# Altium schematic sheet User IO.SchDoc
size A1; SheetNumber: 10; SheetTotal: 14
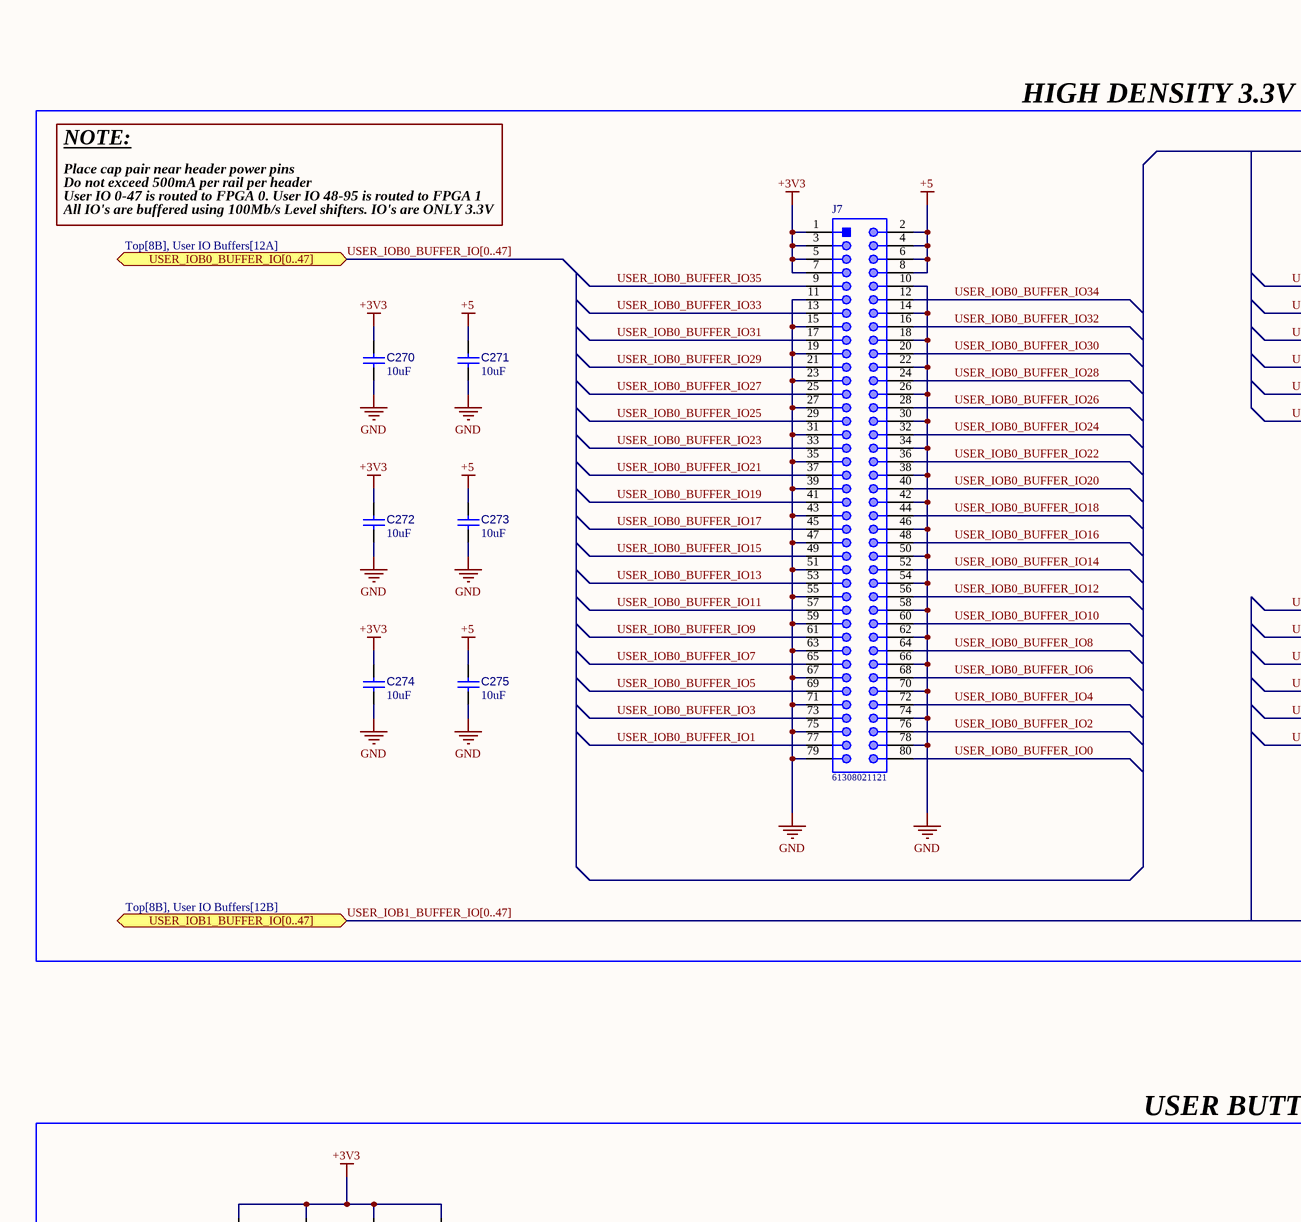
[diagram p0: User IO.SchDoc, top left]
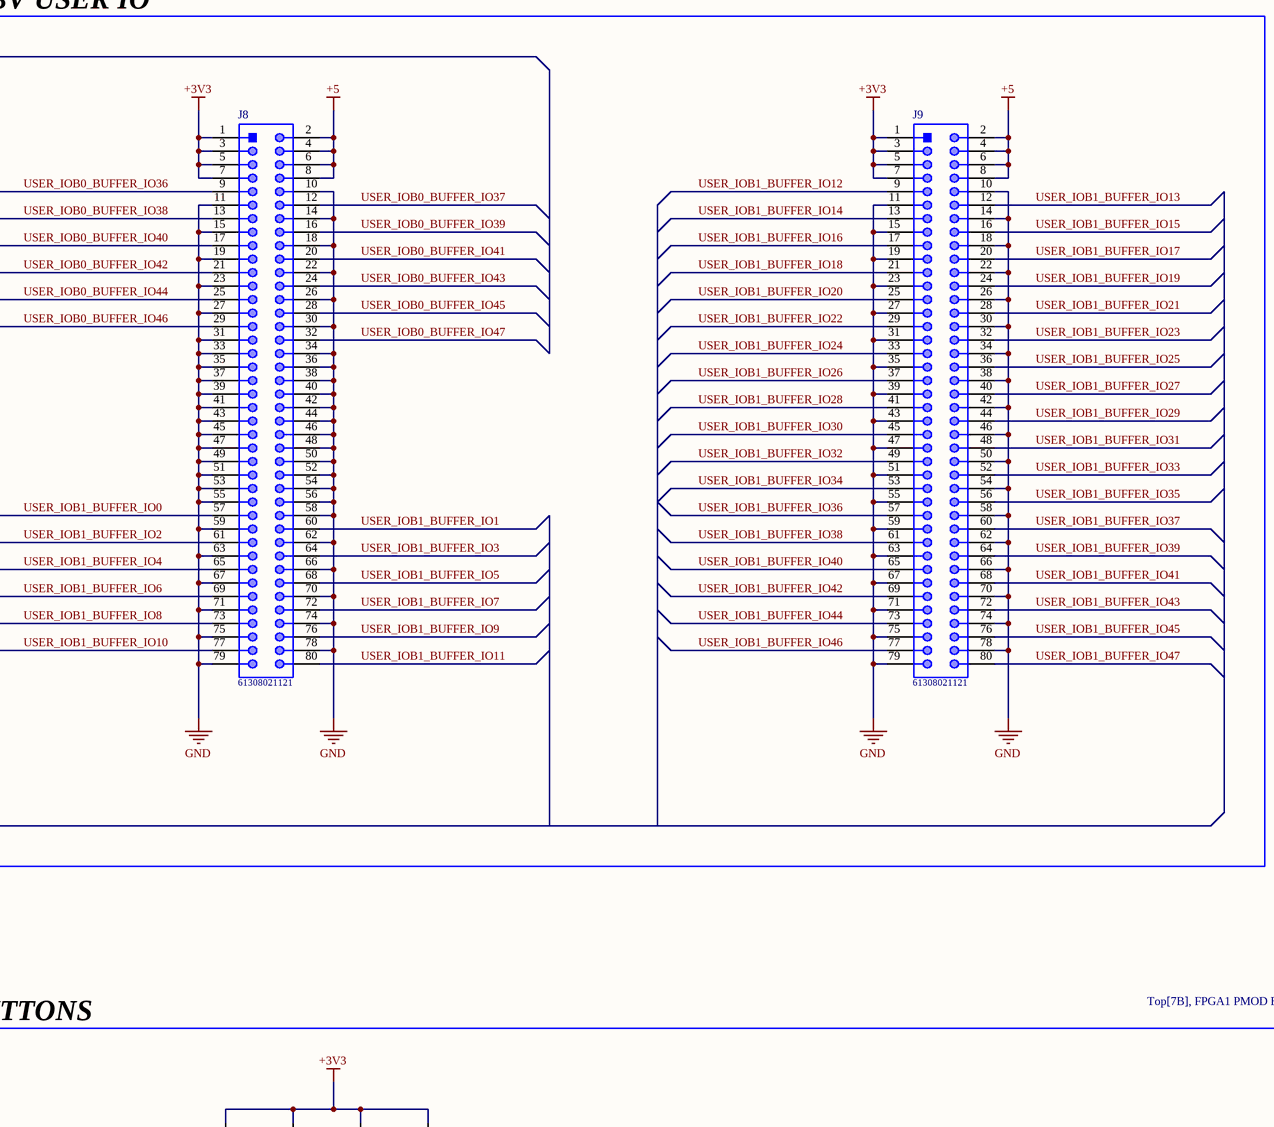
[diagram p1: User IO.SchDoc, top middle]
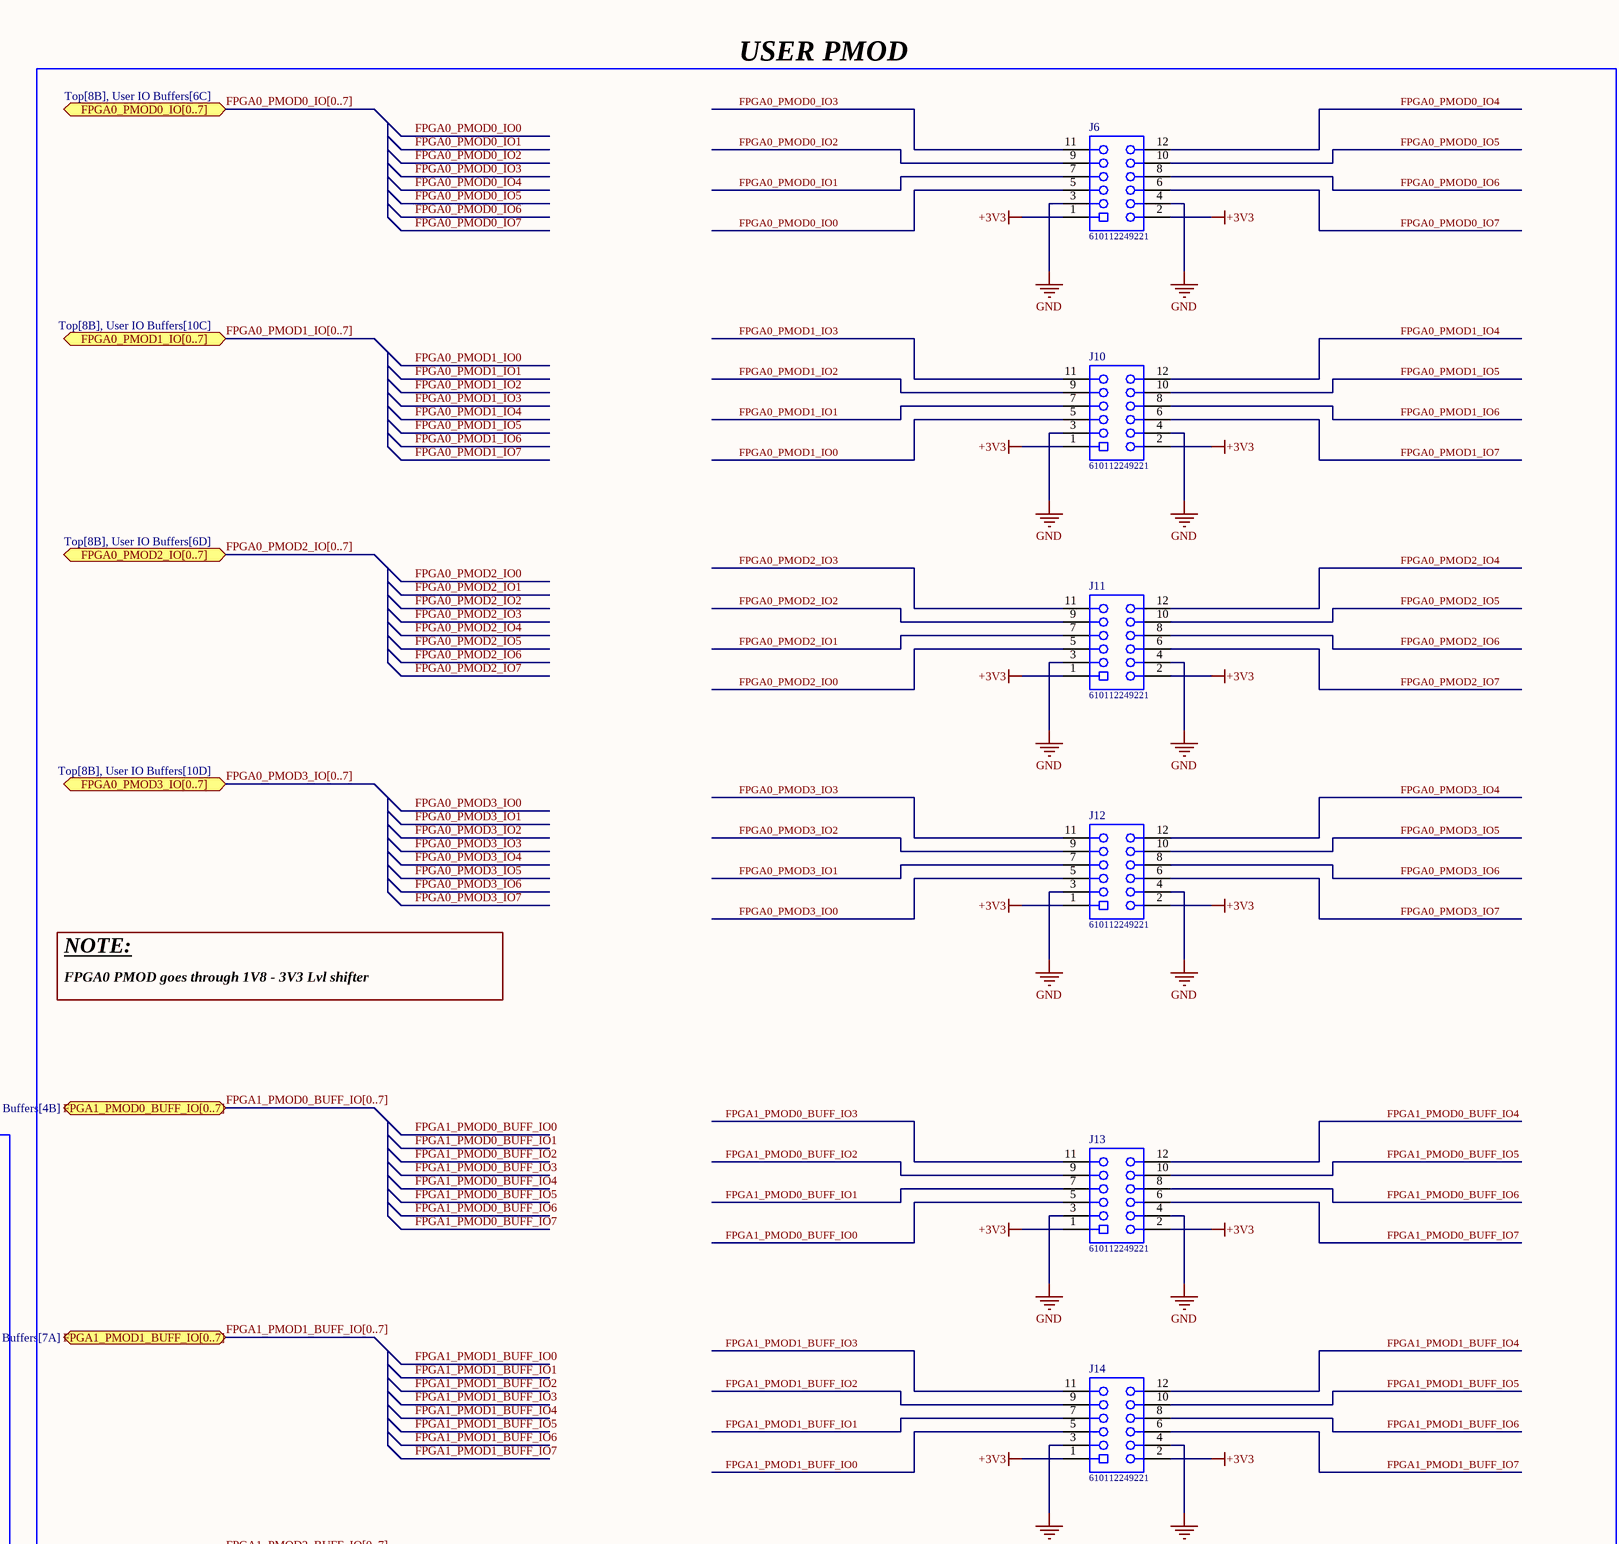
[diagram p2: User IO.SchDoc, top right]
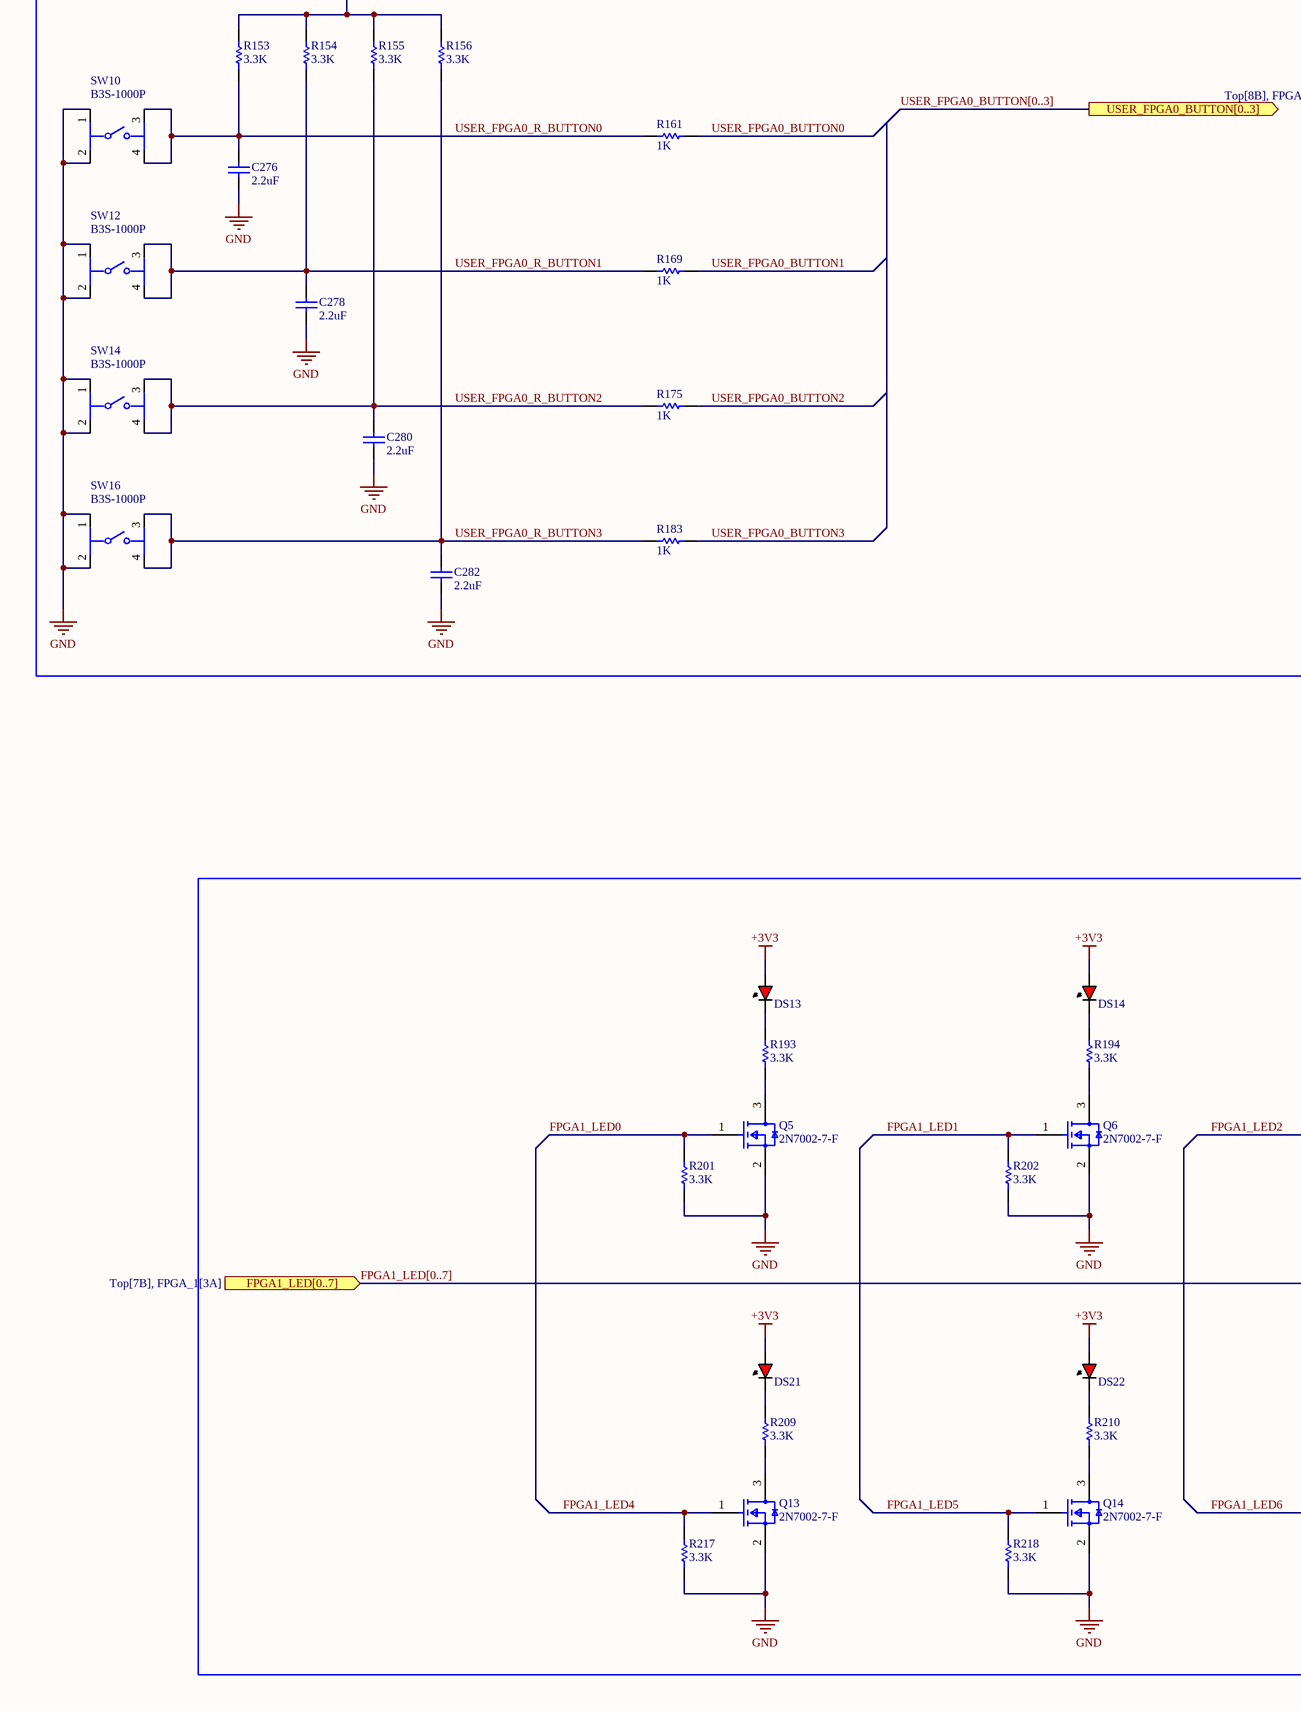
[diagram p3: User IO.SchDoc, bottom left]
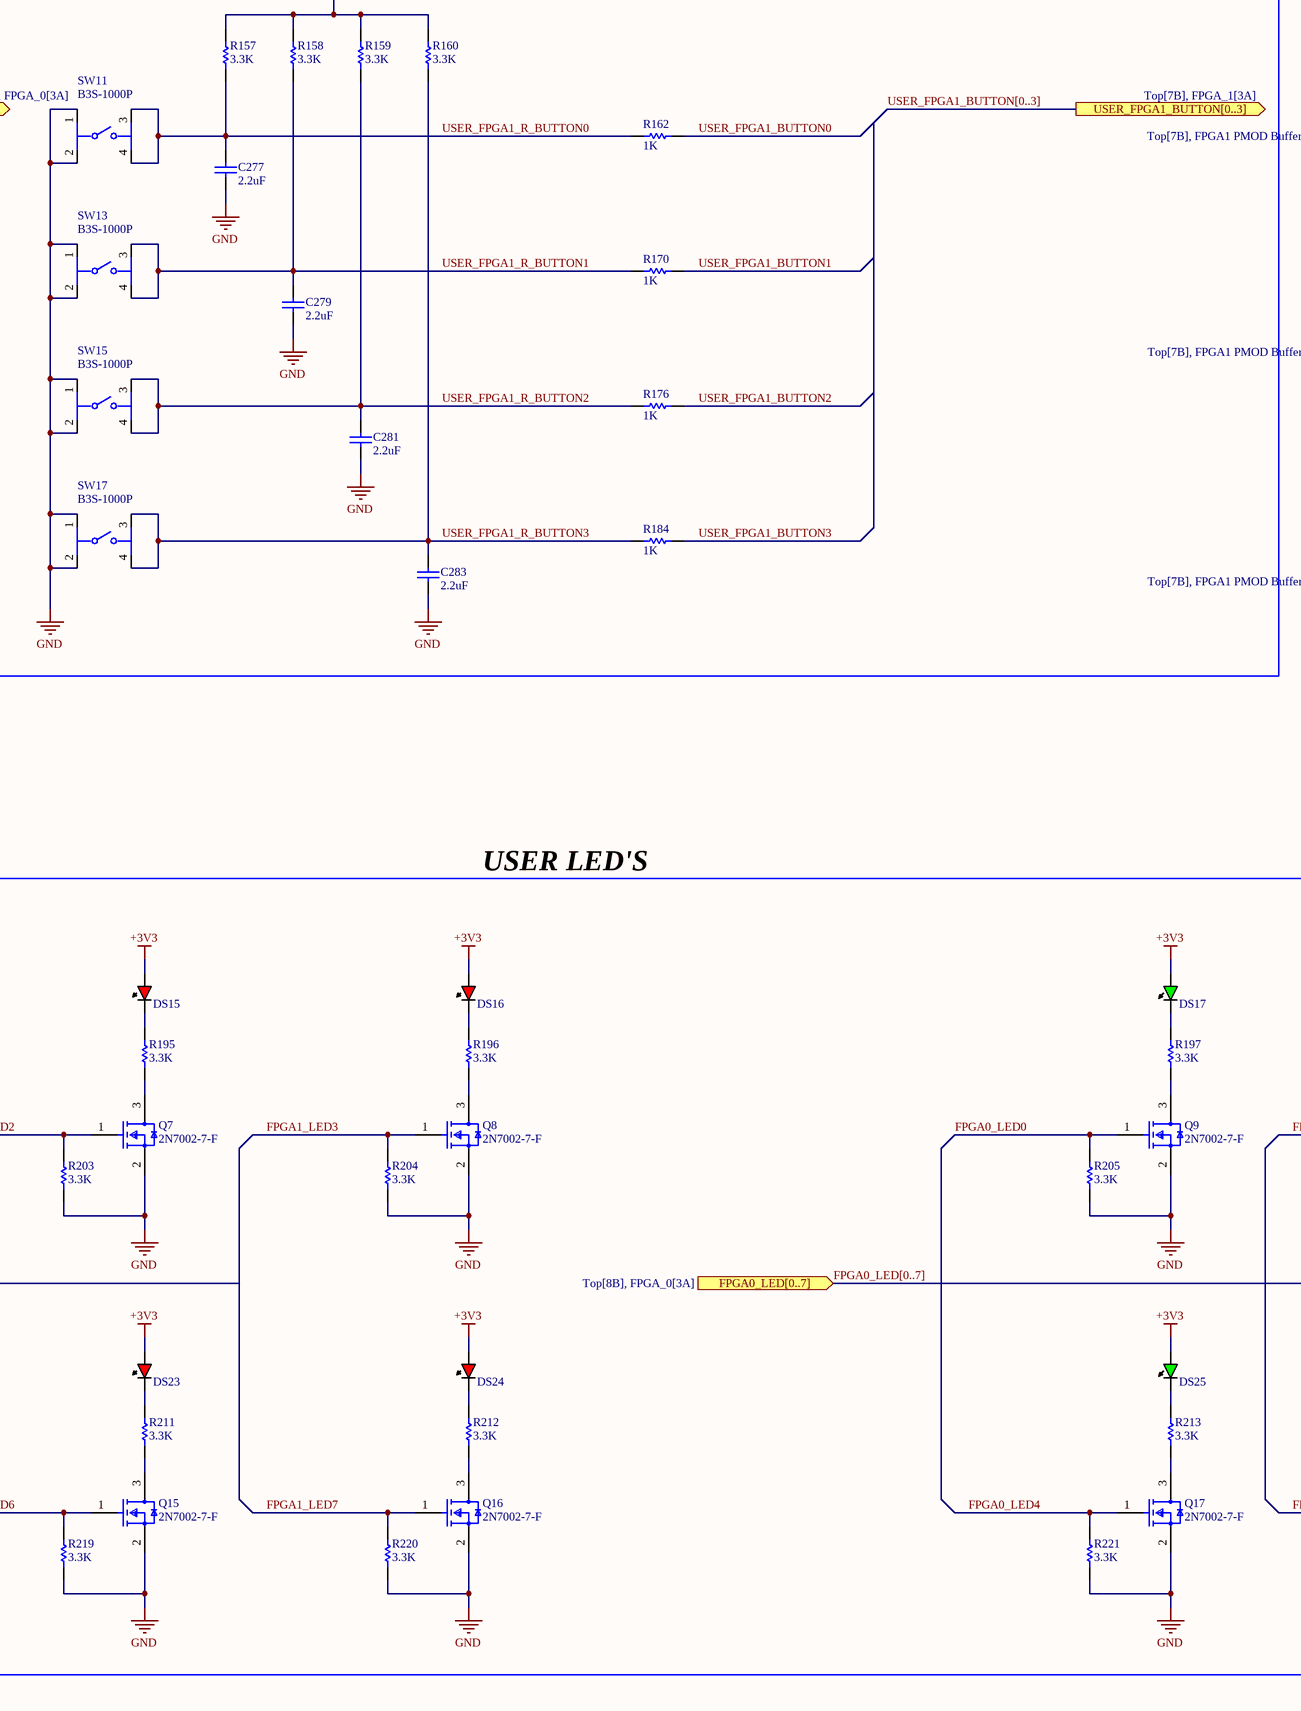
[diagram p4: User IO.SchDoc, bottom middle]
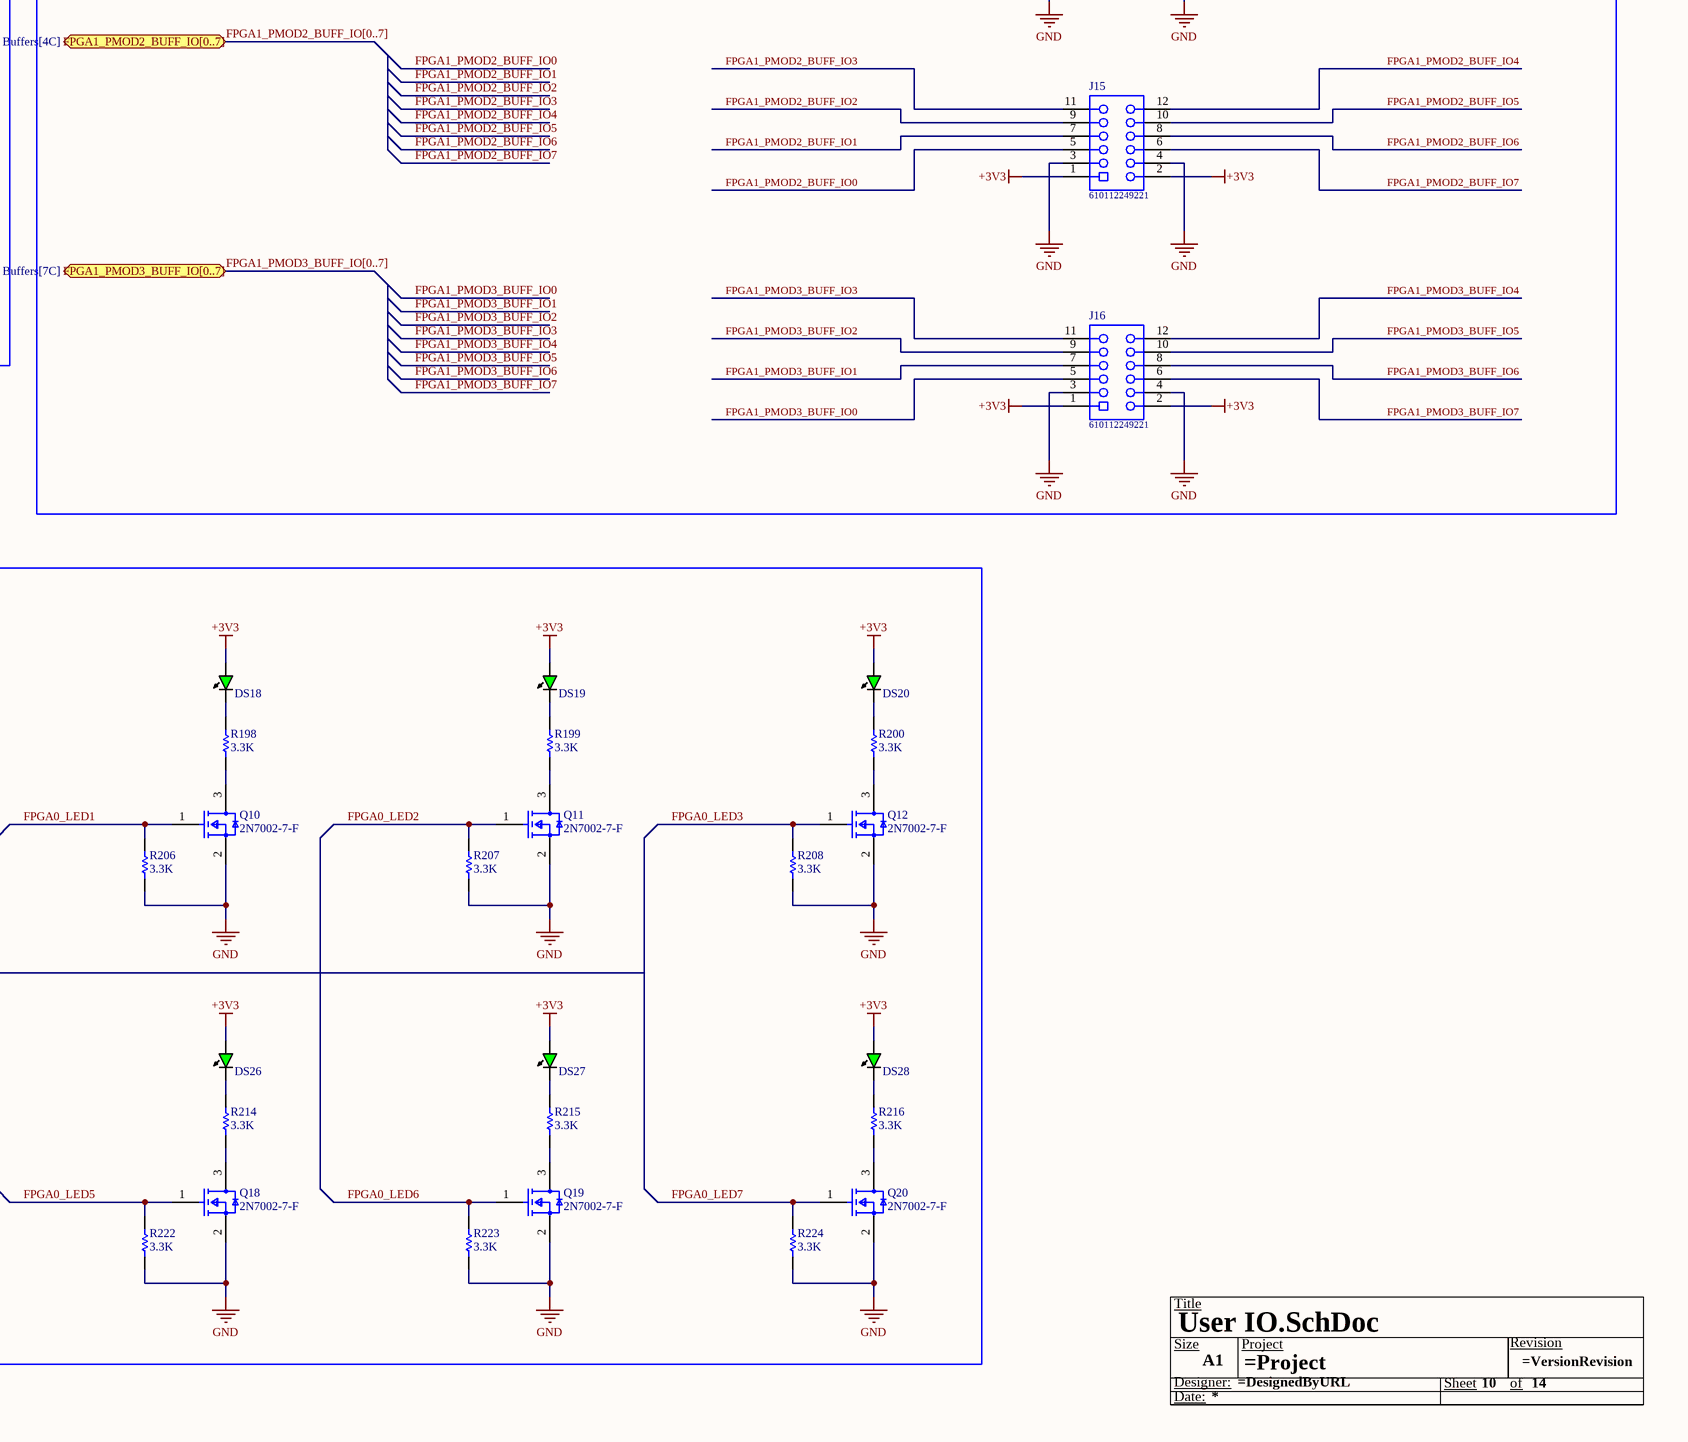
[diagram p5: User IO.SchDoc, bottom right]

## Parts
*  Size: A1  (hidden comment: Title Block)  (graphical)
C270  value 10uF  [CAPC1608X04N]  (hidden comment: GRM188R61E106MA73D)
C271  value 10uF  [CAPC1608X04N]  (hidden comment: GRM188R61E106MA73D)
C272  value 10uF  [CAPC1608X04N]  (hidden comment: GRM188R61E106MA73D)
C273  value 10uF  [CAPC1608X04N]  (hidden comment: GRM188R61E106MA73D)
C274  value 10uF  [CAPC1608X04N]  (hidden comment: GRM188R61E106MA73D)
C275  value 10uF  [CAPC1608X04N]  (hidden comment: GRM188R61E106MA73D)
C276  2.2uF  [CAPC1005X55X25NL05T10]
C277  2.2uF  [CAPC1005X55X25NL05T10]
C278  2.2uF  [CAPC1005X55X25NL05T10]
C279  2.2uF  [CAPC1005X55X25NL05T10]
C280  2.2uF  [CAPC1005X55X25NL05T10]
C281  2.2uF  [CAPC1005X55X25NL05T10]
C282  2.2uF  [CAPC1005X55X25NL05T10]
C283  2.2uF  [CAPC1005X55X25NL05T10]
DS13  TLMS1100-GS08  [VISH-TLMX1100_V]  (value not drawn)
DS14  TLMS1100-GS08  [VISH-TLMX1100_V]  (value not drawn)
DS15  TLMS1100-GS08  [VISH-TLMX1100_V]  (value not drawn)
DS16  TLMS1100-GS08  [VISH-TLMX1100_V]  (value not drawn)
DS17  SMLLX0603GWTR  [LUMX-SML-LX0603_V]  (value not drawn)
DS18  SMLLX0603GWTR  [LUMX-SML-LX0603_V]  (value not drawn)
DS19  SMLLX0603GWTR  [LUMX-SML-LX0603_V]  (value not drawn)
DS20  SMLLX0603GWTR  [LUMX-SML-LX0603_V]  (value not drawn)
DS21  TLMS1100-GS08  [VISH-TLMX1100_V]  (value not drawn)
DS22  TLMS1100-GS08  [VISH-TLMX1100_V]  (value not drawn)
DS23  TLMS1100-GS08  [VISH-TLMX1100_V]  (value not drawn)
DS24  TLMS1100-GS08  [VISH-TLMX1100_V]  (value not drawn)
DS25  SMLLX0603GWTR  [LUMX-SML-LX0603_V]  (value not drawn)
DS26  SMLLX0603GWTR  [LUMX-SML-LX0603_V]  (value not drawn)
DS27  SMLLX0603GWTR  [LUMX-SML-LX0603_V]  (value not drawn)
DS28  SMLLX0603GWTR  [LUMX-SML-LX0603_V]  (value not drawn)
J6  610112249221  [610112249221]
J7  61308021121  [61308021121]
J8  61308021121  [61308021121]
J9  61308021121  [61308021121]
J10  610112249221  [610112249221]
J11  610112249221  [610112249221]
J12  610112249221  [610112249221]
J13  610112249221  [610112249221]
J14  610112249221  [610112249221]
J15  610112249221  [610112249221]
J16  610112249221  [610112249221]
Q5  2N7002-7-F  [FP-SOT23-MFG]
Q6  2N7002-7-F  [FP-SOT23-MFG]
Q7  2N7002-7-F  [FP-SOT23-MFG]
Q8  2N7002-7-F  [FP-SOT23-MFG]
Q9  2N7002-7-F  [FP-SOT23-MFG]
Q10  2N7002-7-F  [FP-SOT23-MFG]
Q11  2N7002-7-F  [FP-SOT23-MFG]
Q12  2N7002-7-F  [FP-SOT23-MFG]
Q13  2N7002-7-F  [FP-SOT23-MFG]
Q14  2N7002-7-F  [FP-SOT23-MFG]
Q15  2N7002-7-F  [FP-SOT23-MFG]
Q16  2N7002-7-F  [FP-SOT23-MFG]
Q17  2N7002-7-F  [FP-SOT23-MFG]
Q18  2N7002-7-F  [FP-SOT23-MFG]
Q19  2N7002-7-F  [FP-SOT23-MFG]
Q20  2N7002-7-F  [FP-SOT23-MFG]
R153  3.3K  [RESC1005X40X25NL05T10]
R154  3.3K  [RESC1005X40X25NL05T10]
R155  3.3K  [RESC1005X40X25NL05T10]
R156  3.3K  [RESC1005X40X25NL05T10]
R157  3.3K  [RESC1005X40X25NL05T10]
R158  3.3K  [RESC1005X40X25NL05T10]
R159  3.3K  [RESC1005X40X25NL05T10]
R160  3.3K  [RESC1005X40X25NL05T10]
R161  1K  [RESC1005X40X25NL05T10]
R162  1K  [RESC1005X40X25NL05T10]
R169  1K  [RESC1005X40X25NL05T10]
R170  1K  [RESC1005X40X25NL05T10]
R175  1K  [RESC1005X40X25NL05T10]
R176  1K  [RESC1005X40X25NL05T10]
R183  1K  [RESC1005X40X25NL05T10]
R184  1K  [RESC1005X40X25NL05T10]
R193  3.3K  [RESC1005X40X25NL05T10]
R194  3.3K  [RESC1005X40X25NL05T10]
R195  3.3K  [RESC1005X40X25NL05T10]
R196  3.3K  [RESC1005X40X25NL05T10]
R197  3.3K  [RESC1005X40X25NL05T10]
R198  3.3K  [RESC1005X40X25NL05T10]
R199  3.3K  [RESC1005X40X25NL05T10]
R200  3.3K  [RESC1005X40X25NL05T10]
R201  3.3K  [RESC1005X40X25NL05T10]
R202  3.3K  [RESC1005X40X25NL05T10]
R203  3.3K  [RESC1005X40X25NL05T10]
R204  3.3K  [RESC1005X40X25NL05T10]
R205  3.3K  [RESC1005X40X25NL05T10]
R206  3.3K  [RESC1005X40X25NL05T10]
R207  3.3K  [RESC1005X40X25NL05T10]
R208  3.3K  [RESC1005X40X25NL05T10]
R209  3.3K  [RESC1005X40X25NL05T10]
R210  3.3K  [RESC1005X40X25NL05T10]
R211  3.3K  [RESC1005X40X25NL05T10]
R212  3.3K  [RESC1005X40X25NL05T10]
R213  3.3K  [RESC1005X40X25NL05T10]
R214  3.3K  [RESC1005X40X25NL05T10]
R215  3.3K  [RESC1005X40X25NL05T10]
R216  3.3K  [RESC1005X40X25NL05T10]
R217  3.3K  [RESC1005X40X25NL05T10]
R218  3.3K  [RESC1005X40X25NL05T10]
R219  3.3K  [RESC1005X40X25NL05T10]
R220  3.3K  [RESC1005X40X25NL05T10]
R221  3.3K  [RESC1005X40X25NL05T10]
R222  3.3K  [RESC1005X40X25NL05T10]
R223  3.3K  [RESC1005X40X25NL05T10]
R224  3.3K  [RESC1005X40X25NL05T10]
SW10  B3S-1000P  [FP-B3S-1000P-MFG]
SW11  B3S-1000P  [FP-B3S-1000P-MFG]
SW12  B3S-1000P  [FP-B3S-1000P-MFG]
SW13  B3S-1000P  [FP-B3S-1000P-MFG]
SW14  B3S-1000P  [FP-B3S-1000P-MFG]
SW15  B3S-1000P  [FP-B3S-1000P-MFG]
SW16  B3S-1000P  [FP-B3S-1000P-MFG]
SW17  B3S-1000P  [FP-B3S-1000P-MFG]

## Blocks framed on the sheet
USER PMOD: J6 J10-J16
HIGH DENSITY 3.3V USER IO: C270-C275 J7-J9
USER BUTTONS: C276-C283 R153-R162 R169 R170 R175 R176 R183 R184 SW10-SW17
USER LED'S: DS13-DS28 Q5-Q20 R193-R224

## Ports
FPGA0_LED[0..7] (in, see Top[8B], FPGA_0[3A]), FPGA0_PMOD0_IO[0..7] (bidir, see Top[8B], User IO Buffers[6C]), FPGA0_PMOD1_IO[0..7] (bidir, see Top[8B], User IO Buffers[10C]), FPGA0_PMOD2_IO[0..7] (bidir, see Top[8B], User IO Buffers[6D]), FPGA0_PMOD3_IO[0..7] (bidir, see Top[8B], User IO Buffers[10D]), FPGA1_LED[0..7] (in, see Top[7B], FPGA_1[3A]), FPGA1_PMOD0_BUFF_IO[0..7] (bidir, see Top[7B], FPGA1 PMOD Buffers[4B]), FPGA1_PMOD1_BUFF_IO[0..7] (bidir, see Top[7B], FPGA1 PMOD Buffers[7A]), FPGA1_PMOD2_BUFF_IO[0..7] (bidir, see Top[7B], FPGA1 PMOD Buffers[4C]), FPGA1_PMOD3_BUFF_IO[0..7] (bidir, see Top[7B], FPGA1 PMOD Buffers[7C]), USER_FPGA0_BUTTON[0..3] (out, see Top[8B], FPGA_0[3A]), USER_FPGA1_BUTTON[0..3] (out, see Top[7B], FPGA_1[3A]), USER_IOB0_BUFFER_IO[0..47] (bidir, see Top[8B], User IO Buffers[12A]), USER_IOB1_BUFFER_IO[0..47] (bidir, see Top[8B], User IO Buffers[12B])

## Nets
+3V3: C270.2 C272.2 C274.2 DS13.1(A) DS14.1(A) DS15.1(A) DS16.1(A) DS17.1(A) DS18.1(A) DS19.1(A) DS20.1(A) DS21.1(A) DS22.1(A) DS23.1(A) DS24.1(A) DS25.1(A) DS26.1(A) DS27.1(A) DS28.1(A) J6.1 J6.2 J7.1 J7.3 J7.5 J7.7 J8.1 J8.3 J8.5 J8.7 J9.1 J9.3 J9.5 J9.7 J10.1 J10.2 J11.1 J11.2 J12.1 J12.2 J13.1 J13.2 J14.1 J14.2 J15.1 J15.2 J16.1 J16.2 R153.2 R154.2 R155.2 R156.2 R157.2 R158.2 R159.2 R160.2
+5: C271.2 C273.2 C275.2 J7.2 J7.4 J7.6 J7.8 J8.2 J8.4 J8.6 J8.8 J9.2 J9.4 J9.6 J9.8
GND: C270.1 C271.1 C272.1 C273.1 C274.1 C275.1 C276.1 C277.1 C278.1 C279.1 C280.1 C281.1 C282.1 C283.1 J6.3 J6.4 J7.10 J7.11 J7.14 J7.15 J7.18 J7.19 J7.22 J7.23 J7.26 J7.27 J7.30 J7.31 J7.34 J7.35 J7.38 J7.39 J7.42 J7.43 J7.46 J7.47 J7.50 J7.51 J7.54 J7.55 J7.58 J7.59 J7.62 J7.63 J7.66 J7.67 J7.70 J7.71 J7.74 J7.75 J7.78 J7.79 J8.10 J8.11 J8.14 J8.15 J8.18 J8.19 J8.22 J8.23 J8.26 J8.27 J8.30 J8.31 J8.33 J8.34 J8.35 J8.36 J8.37 J8.38 J8.39 J8.40 J8.41 J8.42 J8.43 J8.44 J8.45 J8.46 J8.47 J8.48 J8.49 J8.50 J8.51 J8.52 J8.53 J8.54 J8.55 J8.56 J8.58 J8.59 J8.62 J8.63 J8.66 J8.67 J8.70 J8.71 J8.74 J8.75 J8.78 J8.79 J9.10 J9.11 J9.14 J9.15 J9.18 J9.19 J9.22 J9.23 J9.26 J9.27 J9.30 J9.31 J9.34 J9.35 J9.38 J9.39 J9.42 J9.43 J9.46 J9.47 J9.50 J9.51 J9.54 J9.55 J9.58 J9.59 J9.62 J9.63 J9.66 J9.67 J9.70 J9.71 J9.74 J9.75 J9.78 J9.79 J10.3 J10.4 J11.3 J11.4 J12.3 J12.4 J13.3 J13.4 J14.3 J14.4 J15.3 J15.4 J16.3 J16.4 Q5.2(S) Q6.2(S) Q7.2(S) Q8.2(S) Q9.2(S) Q10.2(S) Q11.2(S) Q12.2(S) Q13.2(S) Q14.2(S) Q15.2(S) Q16.2(S) Q17.2(S) Q18.2(S) Q19.2(S) Q20.2(S) R201.2 R202.2 R203.2 R204.2 R205.2 R206.2 R207.2 R208.2 R217.2 R218.2 R219.2 R220.2 R221.2 R222.2 R223.2 R224.2 SW10.1 SW10.2 SW11.1 SW11.2 SW12.1 SW12.2 SW13.1 SW13.2 SW14.1 SW14.2 SW15.1 SW15.2 SW16.1 SW16.2 SW17.1 SW17.2
FPGA0_LED0: Q9.1(G) R205.1
FPGA0_LED1: Q10.1(G) R206.1
FPGA0_LED2: Q11.1(G) R207.1
FPGA0_LED3: Q12.1(G) R208.1
FPGA0_LED4: Q17.1(G) R221.1
FPGA0_LED5: Q18.1(G) R222.1
FPGA0_LED6: Q19.1(G) R223.1
FPGA0_LED7: Q20.1(G) R224.1
FPGA0_PMOD0_IO0: J6.5
FPGA0_PMOD0_IO1: J6.7
FPGA0_PMOD0_IO2: J6.9
FPGA0_PMOD0_IO3: J6.11
FPGA0_PMOD0_IO4: J6.12
FPGA0_PMOD0_IO5: J6.10
FPGA0_PMOD0_IO6: J6.8
FPGA0_PMOD0_IO7: J6.6
FPGA0_PMOD1_IO0: J10.5
FPGA0_PMOD1_IO1: J10.7
FPGA0_PMOD1_IO2: J10.9
FPGA0_PMOD1_IO3: J10.11
FPGA0_PMOD1_IO4: J10.12
FPGA0_PMOD1_IO5: J10.10
FPGA0_PMOD1_IO6: J10.8
FPGA0_PMOD1_IO7: J10.6
FPGA0_PMOD2_IO0: J11.5
FPGA0_PMOD2_IO1: J11.7
FPGA0_PMOD2_IO2: J11.9
FPGA0_PMOD2_IO3: J11.11
FPGA0_PMOD2_IO4: J11.12
FPGA0_PMOD2_IO5: J11.10
FPGA0_PMOD2_IO6: J11.8
FPGA0_PMOD2_IO7: J11.6
FPGA0_PMOD3_IO0: J12.5
FPGA0_PMOD3_IO1: J12.7
FPGA0_PMOD3_IO2: J12.9
FPGA0_PMOD3_IO3: J12.11
FPGA0_PMOD3_IO4: J12.12
FPGA0_PMOD3_IO5: J12.10
FPGA0_PMOD3_IO6: J12.8
FPGA0_PMOD3_IO7: J12.6
FPGA1_LED0: Q5.1(G) R201.1
FPGA1_LED1: Q6.1(G) R202.1
FPGA1_LED2: Q7.1(G) R203.1
FPGA1_LED3: Q8.1(G) R204.1
FPGA1_LED4: Q13.1(G) R217.1
FPGA1_LED5: Q14.1(G) R218.1
FPGA1_LED6: Q15.1(G) R219.1
FPGA1_LED7: Q16.1(G) R220.1
FPGA1_PMOD0_BUFF_IO0: J13.5
FPGA1_PMOD0_BUFF_IO1: J13.7
FPGA1_PMOD0_BUFF_IO2: J13.9
FPGA1_PMOD0_BUFF_IO3: J13.11
FPGA1_PMOD0_BUFF_IO4: J13.12
FPGA1_PMOD0_BUFF_IO5: J13.10
FPGA1_PMOD0_BUFF_IO6: J13.8
FPGA1_PMOD0_BUFF_IO7: J13.6
FPGA1_PMOD1_BUFF_IO0: J14.5
FPGA1_PMOD1_BUFF_IO1: J14.7
FPGA1_PMOD1_BUFF_IO2: J14.9
FPGA1_PMOD1_BUFF_IO3: J14.11
FPGA1_PMOD1_BUFF_IO4: J14.12
FPGA1_PMOD1_BUFF_IO5: J14.10
FPGA1_PMOD1_BUFF_IO6: J14.8
FPGA1_PMOD1_BUFF_IO7: J14.6
FPGA1_PMOD2_BUFF_IO0: J15.5
FPGA1_PMOD2_BUFF_IO1: J15.7
FPGA1_PMOD2_BUFF_IO2: J15.9
FPGA1_PMOD2_BUFF_IO3: J15.11
FPGA1_PMOD2_BUFF_IO4: J15.12
FPGA1_PMOD2_BUFF_IO5: J15.10
FPGA1_PMOD2_BUFF_IO6: J15.8
FPGA1_PMOD2_BUFF_IO7: J15.6
FPGA1_PMOD3_BUFF_IO0: J16.5
FPGA1_PMOD3_BUFF_IO1: J16.7
FPGA1_PMOD3_BUFF_IO2: J16.9
FPGA1_PMOD3_BUFF_IO3: J16.11
FPGA1_PMOD3_BUFF_IO4: J16.12
FPGA1_PMOD3_BUFF_IO5: J16.10
FPGA1_PMOD3_BUFF_IO6: J16.8
FPGA1_PMOD3_BUFF_IO7: J16.6
USER_FPGA0_BUTTON0: R161.1
USER_FPGA0_BUTTON1: R169.1
USER_FPGA0_BUTTON2: R175.1
USER_FPGA0_BUTTON3: R183.1
USER_FPGA0_R_BUTTON0: C276.2 R153.1 R161.2 SW10.3 SW10.4
USER_FPGA0_R_BUTTON1: C278.2 R154.1 R169.2 SW12.3 SW12.4
USER_FPGA0_R_BUTTON2: C280.2 R155.1 R175.2 SW14.3 SW14.4
USER_FPGA0_R_BUTTON3: C282.2 R156.1 R183.2 SW16.3 SW16.4
USER_FPGA1_BUTTON0: R162.1
USER_FPGA1_BUTTON1: R170.1
USER_FPGA1_BUTTON2: R176.1
USER_FPGA1_BUTTON3: R184.1
USER_FPGA1_R_BUTTON0: C277.2 R157.1 R162.2 SW11.3 SW11.4
USER_FPGA1_R_BUTTON1: C279.2 R158.1 R170.2 SW13.3 SW13.4
USER_FPGA1_R_BUTTON2: C281.2 R159.1 R176.2 SW15.3 SW15.4
USER_FPGA1_R_BUTTON3: C283.2 R160.1 R184.2 SW17.3 SW17.4
USER_IOB0_BUFFER_IO0: J7.80
USER_IOB0_BUFFER_IO1: J7.77
USER_IOB0_BUFFER_IO2: J7.76
USER_IOB0_BUFFER_IO3: J7.73
USER_IOB0_BUFFER_IO4: J7.72
USER_IOB0_BUFFER_IO5: J7.69
USER_IOB0_BUFFER_IO6: J7.68
USER_IOB0_BUFFER_IO7: J7.65
USER_IOB0_BUFFER_IO8: J7.64
USER_IOB0_BUFFER_IO9: J7.61
USER_IOB0_BUFFER_IO10: J7.60
USER_IOB0_BUFFER_IO11: J7.57
USER_IOB0_BUFFER_IO12: J7.56
USER_IOB0_BUFFER_IO13: J7.53
USER_IOB0_BUFFER_IO14: J7.52
USER_IOB0_BUFFER_IO15: J7.49
USER_IOB0_BUFFER_IO16: J7.48
USER_IOB0_BUFFER_IO17: J7.45
USER_IOB0_BUFFER_IO18: J7.44
USER_IOB0_BUFFER_IO19: J7.41
USER_IOB0_BUFFER_IO20: J7.40
USER_IOB0_BUFFER_IO21: J7.37
USER_IOB0_BUFFER_IO22: J7.36
USER_IOB0_BUFFER_IO23: J7.33
USER_IOB0_BUFFER_IO24: J7.32
USER_IOB0_BUFFER_IO25: J7.29
USER_IOB0_BUFFER_IO26: J7.28
USER_IOB0_BUFFER_IO27: J7.25
USER_IOB0_BUFFER_IO28: J7.24
USER_IOB0_BUFFER_IO29: J7.21
USER_IOB0_BUFFER_IO30: J7.20
USER_IOB0_BUFFER_IO31: J7.17
USER_IOB0_BUFFER_IO32: J7.16
USER_IOB0_BUFFER_IO33: J7.13
USER_IOB0_BUFFER_IO34: J7.12
USER_IOB0_BUFFER_IO35: J7.9
USER_IOB0_BUFFER_IO36: J8.9
USER_IOB0_BUFFER_IO37: J8.12
USER_IOB0_BUFFER_IO38: J8.13
USER_IOB0_BUFFER_IO39: J8.16
USER_IOB0_BUFFER_IO40: J8.17
USER_IOB0_BUFFER_IO41: J8.20
USER_IOB0_BUFFER_IO42: J8.21
USER_IOB0_BUFFER_IO43: J8.24
USER_IOB0_BUFFER_IO44: J8.25
USER_IOB0_BUFFER_IO45: J8.28
USER_IOB0_BUFFER_IO46: J8.29
USER_IOB0_BUFFER_IO47: J8.32
USER_IOB1_BUFFER_IO0: J8.57
USER_IOB1_BUFFER_IO1: J8.60
USER_IOB1_BUFFER_IO2: J8.61
USER_IOB1_BUFFER_IO3: J8.64
USER_IOB1_BUFFER_IO4: J8.65
USER_IOB1_BUFFER_IO5: J8.68
USER_IOB1_BUFFER_IO6: J8.69
USER_IOB1_BUFFER_IO7: J8.72
USER_IOB1_BUFFER_IO8: J8.73
USER_IOB1_BUFFER_IO9: J8.76
USER_IOB1_BUFFER_IO10: J8.77
USER_IOB1_BUFFER_IO11: J8.80
USER_IOB1_BUFFER_IO12: J9.9
USER_IOB1_BUFFER_IO13: J9.12
USER_IOB1_BUFFER_IO14: J9.13
USER_IOB1_BUFFER_IO15: J9.16
USER_IOB1_BUFFER_IO16: J9.17
USER_IOB1_BUFFER_IO17: J9.20
USER_IOB1_BUFFER_IO18: J9.21
USER_IOB1_BUFFER_IO19: J9.24
USER_IOB1_BUFFER_IO20: J9.25
USER_IOB1_BUFFER_IO21: J9.28
USER_IOB1_BUFFER_IO22: J9.29
USER_IOB1_BUFFER_IO23: J9.32
USER_IOB1_BUFFER_IO24: J9.33
USER_IOB1_BUFFER_IO25: J9.36
USER_IOB1_BUFFER_IO26: J9.37
USER_IOB1_BUFFER_IO27: J9.40
USER_IOB1_BUFFER_IO28: J9.41
USER_IOB1_BUFFER_IO29: J9.44
USER_IOB1_BUFFER_IO30: J9.45
USER_IOB1_BUFFER_IO31: J9.48
USER_IOB1_BUFFER_IO32: J9.49
USER_IOB1_BUFFER_IO33: J9.52
USER_IOB1_BUFFER_IO34: J9.53
USER_IOB1_BUFFER_IO35: J9.56
USER_IOB1_BUFFER_IO36: J9.57
USER_IOB1_BUFFER_IO37: J9.60
USER_IOB1_BUFFER_IO38: J9.61
USER_IOB1_BUFFER_IO39: J9.64
USER_IOB1_BUFFER_IO40: J9.65
USER_IOB1_BUFFER_IO41: J9.68
USER_IOB1_BUFFER_IO42: J9.69
USER_IOB1_BUFFER_IO43: J9.72
USER_IOB1_BUFFER_IO44: J9.73
USER_IOB1_BUFFER_IO45: J9.76
USER_IOB1_BUFFER_IO46: J9.77
USER_IOB1_BUFFER_IO47: J9.80
NetDS13_2: DS13.2(K) R193.2
NetDS14_2: DS14.2(K) R194.2
NetDS15_2: DS15.2(K) R195.2
NetDS16_2: DS16.2(K) R196.2
NetDS17_2: DS17.2(K) R197.2
NetDS18_2: DS18.2(K) R198.2
NetDS19_2: DS19.2(K) R199.2
NetDS20_2: DS20.2(K) R200.2
NetDS21_2: DS21.2(K) R209.2
NetDS22_2: DS22.2(K) R210.2
NetDS23_2: DS23.2(K) R211.2
NetDS24_2: DS24.2(K) R212.2
NetDS25_2: DS25.2(K) R213.2
NetDS26_2: DS26.2(K) R214.2
NetDS27_2: DS27.2(K) R215.2
NetDS28_2: DS28.2(K) R216.2
NetQ5_3: Q5.3(D) R193.1
NetQ6_3: Q6.3(D) R194.1
NetQ7_3: Q7.3(D) R195.1
NetQ8_3: Q8.3(D) R196.1
NetQ9_3: Q9.3(D) R197.1
NetQ10_3: Q10.3(D) R198.1
NetQ11_3: Q11.3(D) R199.1
NetQ12_3: Q12.3(D) R200.1
NetQ13_3: Q13.3(D) R209.1
NetQ14_3: Q14.3(D) R210.1
NetQ15_3: Q15.3(D) R211.1
NetQ16_3: Q16.3(D) R212.1
NetQ17_3: Q17.3(D) R213.1
NetQ18_3: Q18.3(D) R214.1
NetQ19_3: Q19.3(D) R215.1
NetQ20_3: Q20.3(D) R216.1

## Buses and harness runs
bus FPGA0_LED[0..7] = port FPGA0_LED[0..7]
bus FPGA0_PMOD0_IO[0..7] = port FPGA0_PMOD0_IO[0..7]
bus FPGA0_PMOD1_IO[0..7] = port FPGA0_PMOD1_IO[0..7]
bus FPGA0_PMOD2_IO[0..7] = port FPGA0_PMOD2_IO[0..7]
bus FPGA0_PMOD3_IO[0..7] = port FPGA0_PMOD3_IO[0..7]
bus FPGA1_LED[0..7] = port FPGA1_LED[0..7]
bus FPGA1_PMOD0_BUFF_IO[0..7] = port FPGA1_PMOD0_BUFF_IO[0..7]
bus FPGA1_PMOD1_BUFF_IO[0..7] = port FPGA1_PMOD1_BUFF_IO[0..7]
bus FPGA1_PMOD2_BUFF_IO[0..7] = port FPGA1_PMOD2_BUFF_IO[0..7]
bus FPGA1_PMOD3_BUFF_IO[0..7] = port FPGA1_PMOD3_BUFF_IO[0..7]
bus USER_FPGA0_BUTTON[0..3] = port USER_FPGA0_BUTTON[0..3]
bus USER_FPGA1_BUTTON[0..3] = port USER_FPGA1_BUTTON[0..3]
bus USER_IOB0_BUFFER_IO[0..47] = port USER_IOB0_BUFFER_IO[0..47]
bus USER_IOB1_BUFFER_IO[0..47] = port USER_IOB1_BUFFER_IO[0..47]

## Notes on the sheet
- NOTE:
- Place cap pair near header power pins
- Do not exceed 500mA per rail per header
- User IO 0-47 is routed to FPGA 0. User IO 48-95 is routed to FPGA 1
- All IO's are buffered using 100Mb/s Level shifters. IO's are ONLY 3.3V
- FPGA0 PMOD goes through 1V8 - 3V3 Lvl shifter
- (in symbol CMP-007-000006-8) Title; Size; Project; Revision; Designer:; Sheet; of; Date:

## Library data of the parts
* = CMP-007-000006-8: Generic Title Block
C270-C275 = CMP-001-00096-1: CAP CER 10UF 25V X5R 0603; Tolerance: 20%; Dielectric: X5R; Case/Package: 0603; Voltage: 25V
C276-C283 = CMP-2008-04543-1: GRM155R60J225ME15D; Manufacturer: Murata; Part Number: GRM155R60J225ME15D
DS13-DS16 DS21-DS24 = CMP-007-00036-1: LED Uni-Color Red 633nm Automotive 2-Pin Chip 0603(1608Metric) T/R; Case/Package: SMD/SMT; Color: Red
DS17-DS20 DS25-DS28 = CMP-007-00037-1: LED GREEN DIFFUSED SMD; Color: Green; Case/Package: 0603
J6 J10-J16 = CMP-1502-01390-1: SMT Angled Socket Header WR-PHD, Pitch 2.54 mm, Dual Row, 12 pins; Manufacturer: Wurth Elektronik; Working Voltage: 250VAC; Pin Number: 12; Contact Resistance: 20mOhm; Rated Current: 3A; Withstanding Voltage: 600VAC; Gender: Female; Pitch: 2.54mm; Row Number: Dual; Mounting Technology: SMT; Orientation: Angled; Package Reference: 610112249221; Manufacturer URL: http://www.we-online.de; Publisher: WurthElektronik; Datasheet URL: https://katalog.we-online.de/em/datasheet/6101xx249221.pdf; Packaging: TapeandReel; Part Number: 610112249221; Operating Temperature: -40to105degC
J7-J9 = CMP-1502-01145-1: THT Vertical Pin Header WR-PHD, Pitch 2.54 mm, Dual Row, 80 pins; Manufacturer: Wurth Elektronik; Pin Number: 80; Contact Resistance: 20mOhm; Working Voltage: 250VAC; Rated Current: 3A; Gender: Male; Withstanding Voltage: 500VAC; Pitch: 2.54mm; Manufacturer URL: http://www.we-online.de; Operating Temperature: -40to105degC; Publisher: WurthElektronik; Row Number: Dual; Datasheet URL: https://katalog.we-online.de/em/datasheet/6130xx21121.pdf; Packaging: Bag; Part Number: 61308021121; Mounting Technology: THT; Orientation: Vertical; Package Reference: 61308021121
Q5-Q20 = CMP-2000-04929-2: MOSFET N-CH 60V 115MA SOT23-3; Turn-On Delay Time: 7ns; Turn-Off Delay Time: 11ns; Drain to Source Resistance: 7.5R; Rise Time: 3ns; Drain to Source Breakdown Voltage: 70V; Input Capacitance: 50pF; Number of Elements: 1; Power Dissipation: 540mW; Max Power Dissipation: 300mW; Fall Time: 5.6ns; Gate to Source Voltage (Vgs): 20V; Threshold Voltage: 2.5V; Element Configuration: Single; Termination: SMD/SMT; Weight: 0.000282oz; Radiation Hardening: No; Max Operating Temperature: 150°C; On-State Resistance: 7.5R; Mount: Surface Mount; Current Rating: 115mA; Contact Plating: Tin; Lead Free: Lead Free; Min Operating Temperature: -55°C; Number of Pins: 3; REACH SVHC: No SVHC; Drain to Source Voltage (Vdss): 60V; Width: 1.3mm; Package Quantity: 3000; Length: 2.9mm; Case/Package: SOT-23; Number of Channels: 1; Dual Supply Voltage: 60V; Packaging: Tape and Reel; Height: 1mm; Voltage Rating (DC): 60V; Nominal Vgs: 2.5V; Continuous Drain Current (ID): 115mA; Voltage: 60V; Rds On Max: 7.5R
R153-R160 R193-R224 = CMP-2002-03055-1: CRCW04023K30FKEDHP; Manufacturer: Vishay Dale; Part Number: CRCW04023K30FKEDHP
R161 R162 R169 R170 R175 R176 R183 R184 = CMP-2002-03045-1: CRCW04021K00FKEDHP; Manufacturer: Vishay Dale; Part Number: CRCW04021K00FKEDHP
SW10-SW17 = CMP-08834-000008-1: SWITCH TACTILE SPST-NO 0.05A 24V; Throw Configuration: SPST; Switch Function: Off-Mom; Switch Travel: 0.25mm; Contact Current Rating: 50mA; Actuator Length: 0.8mm; Mechanical Life: 500000Cycles; Contact Resistance: 100mR; Operating Force: 1.57N; Actuator Type: Standard; Illumination Type: Non-Illuminated; Ratings: IP67; Number of Poles: 1; Package Quantity: 1; Orientation: Straight; REACH SVHC: No SVHC; Lead Free: Lead Free; Max Current Rating: 50mA; Contact Plating: Silver; Current Rating: 50mA; Depth: 9mm; Contact Material: Bronze; Electrical Life: 500000Cycles; Termination: Gull Wing; Width: 6mm; Packaging: Tape and Reel; Min Operating Temperature: -25°C; Radiation Hardening: No; Max Voltage Rating (DC): 24V; Max Operating Temperature: 70°C; Length: 6.6mm; Height: 3.65mm; Voltage Rating (DC): 24V; Weight: 0.010582oz; Mount: Surface Mount